# Altium project ndal_STM.PrjPcb
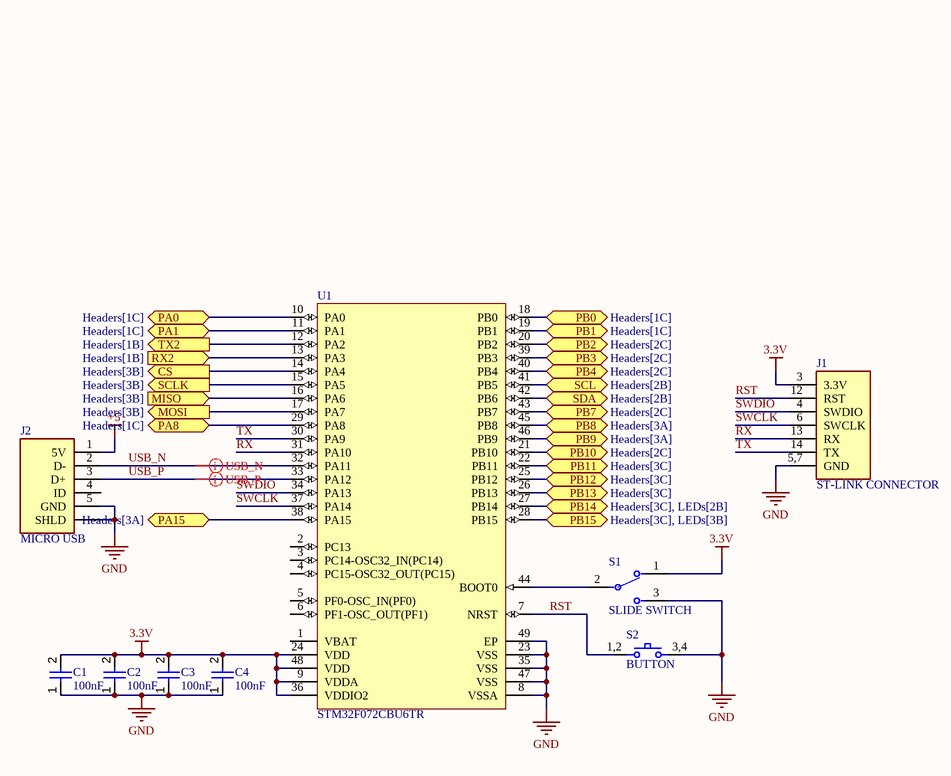
[diagram p0: STM.SchDoc]
4 sheets, 28 parts. Net scope: flat (ports and power ports of the same name join across sheets).
Board file: PCB.PcbDoc
Sheets:
  STM.SchDoc
  Power.SchDoc
  Headers.SchDoc
  LEDs.SchDoc

## Sheet STM.SchDoc
size A; SheetNumber: 1; SheetTotal: 4

### Parts
C1  value 100nF  [CAP_0603]  (hidden comment: CAP .1uF)
C2  value 100nF  [CAP_0603]  (hidden comment: CAP .1uF)
C3  value 100nF  [CAP_0603]  (hidden comment: CAP .1uF)
C4  value 100nF  [CAP_0603]  (hidden comment: CAP .1uF)
J1  ST-LINK CONNECTOR  [FTSH10701LDVKTR]
J2  MICRO USB  [101181940001LF]
S1  SLIDE SWITCH  [SLW8839352AD]
S2  BUTTON  [TS026643BK100SCRD]
U1  STM32F072CBU6TR  [STM-UFQFPN48_L]

### Ports
CS (out, see Headers[3B]), MISO (in, see Headers[3B]), MOSI (out, see Headers[3B]), PA0 (bidir, see Headers[1C]), PA1 (bidir, see Headers[1C]), PA8 (bidir, see Headers[1C]), PA15 (bidir, see Headers[3A]), PB0 (bidir, see Headers[1C]), PB1 (bidir, see Headers[1C]), PB2 (bidir, see Headers[2C]), PB3 (bidir, see Headers[2C]), PB4 (bidir, see Headers[2C]), PB7 (bidir, see Headers[2C]), PB8 (bidir, see Headers[3A]), PB9 (bidir, see Headers[3A]), PB10 (bidir, see Headers[2C]), PB11 (bidir, see Headers[3C]), PB12 (bidir, see Headers[3C]), PB13 (bidir, see Headers[3C]), PB14 (bidir, see Headers[3C], LEDs[2B]), PB15 (bidir, see Headers[3C], LEDs[3B]), RX2 (in, see Headers[1B]), SCL (bidir, see Headers[2B]), SCLK (out, see Headers[3B]), SDA (bidir, see Headers[2B]), TX2 (out, see Headers[1B])

### Nets
3.3V: C1.2 C2.2 C3.2 C4.2 J1.3(3.3V) S1.1 U1.9(VDDA) U1.24(VDD) U1.36(VDDIO2) U1.48(VDD)
+5: J2.1(5V)
GND: C1.1 C2.1 C3.1 C4.1 J1.5,7(GND) J2.5(GND) J2.SHLD S1.3 S2.3,4 U1.8(VSSA) U1.23(VSS) U1.35(VSS) U1.47(VSS) U1.49(EP)
RST: J1.12(RST) S2.1,2 U1.7(NRST)
RX: J1.13(RX) U1.31(PA10)
SWCLK: J1.6(SWCLK) U1.37(PA14)
SWDIO: J1.4(SWDIO) U1.34(PA13)
TX: J1.14(TX) U1.30(PA9)
USB_N: J2.2(D-) U1.32(PA11)
USB_P: J2.3(D+) U1.33(PA12)
NetJ4_1: U1.38(PA15) ; port PA15
NetJ4_2: U1.45(PB8) ; port PB8
NetJ4_3: U1.46(PB9) ; port PB9
NetJ5_1: U1.12(PA2) ; port TX2
NetJ5_2: U1.13(PA3) ; port RX2
NetJ6_1: U1.16(PA6) ; port MISO
NetJ6_2: U1.17(PA7) ; port MOSI
NetJ6_3: U1.15(PA5) ; port SCLK
NetJ6_4: U1.14(PA4) ; port CS
NetJ7_1: U1.42(PB6) ; port SDA
NetJ7_2: U1.41(PB5) ; port SCL
NetJ8_1: U1.10(PA0) ; port PA0
NetJ8_2: U1.11(PA1) ; port PA1
NetJ8_3: U1.29(PA8) ; port PA8
NetJ8_4: U1.18(PB0) ; port PB0
NetJ8_5: U1.19(PB1) ; port PB1
NetJ9_1: U1.20(PB2) ; port PB2
NetJ9_2: U1.39(PB3) ; port PB3
NetJ9_3: U1.40(PB4) ; port PB4
NetJ9_4: U1.43(PB7) ; port PB7
NetJ9_5: U1.21(PB10) ; port PB10
NetJ10_1: U1.22(PB11) ; port PB11
NetJ10_2: U1.25(PB12) ; port PB12
NetJ10_3: U1.26(PB13) ; port PB13
NetJ10_4: U1.27(PB14) ; port PB14
NetJ10_5: U1.28(PB15) ; port PB15
NetS1_2: S1.2(C) U1.44(BOOT0)

Not connected (* = marked no-connect by the designer): J2 4(ID); U1 1(VBAT) 2(PC13) 3(PC14-OSC32_IN(PC14)) 4(PC15-OSC32_OUT(PC15)) 5(PF0-OSC_IN(PF0)) 6(PF1-OSC_OUT(PF1))

### Layout directives
differential pair: USB_N, USB_P

### Library data of the parts
C1-C4 = CMP-001-00086-1: Capacitor .1uF 10% 16V 0603; Voltage Rating: 16V; Source: Generic_Schematic_Library.SchLib; Design Item ID: CAP .1uF; Tolerance: 10%
J1 = CMP-002-00025-2: Connector; Manufacturer_Name: SAMTEC; Manufacturer_Part_Number: FTSH-107-01-L-DV-K-TR; Pins: 7; Design Item ID: ST-LINK CONNECTOR; Component Type: Standard; Source: SamacSys.SchLib; Mouser Part Number: 200-FTSH10701LDVKTR; Arrow Part Number: FTSH-107-01-L-DV-K-TR; Mouser Price/Stock: https://www.mouser.co.uk/ProductDetail/Samtec/FTSH-107-01-L-DV-K-TR?qs=%252BZP6%2F%252BtExtDlh0wyxE013Q%3D%3D; Height: 6.25mm; Arrow Price/Stock: https://www.arrow.com/en/products/ftsh-107-01-l-dv-k-tr/samtec?utm_currency=USD&region=nac; Datasheet Link: https://suddendocs.samtec.com/prints/ftsh-1xx-xx-xxx-dv-xxx-xxx-x-xx-mkt.pdf?_gl=1*mdiyn1*_ga*MTcyMTUxMTIwMy4xNzEyMDQxMTc2*_ga_3KFNZC07WW*MTcxMjEzMDIxOS4yLjEuMTcxMjEzMDI1NC4yNS4wLjA.
J2 = CMP-00030-1: Connector; pin to pad: SHLD>MH1+MH2+MH3+MH4+MP1+MP2; Manufacturer_Name: Amphenol Communications Solutions; Height: 3.25mm; Manufacturer_Part_Number: 10118194-0001LF; Source: SamacSys.SchLib; Design Item ID: 10118194-0001LF; Datasheet Link: https://www.amphenol-cs.com/micro-usb-101181940001lf.html; Arrow Price/Stock: https://www.arrow.com/en/products/10118194-0001lf/amphenol-fci?utm_currency=USD&region=nac; Arrow Part Number: 10118194-0001LF
S1 = CMP-00033-2: Switch; Manufacturer_Name: Same Sky; Design Item ID: SLW-883935-2A-D; Datasheet Link: https://www.sameskydevices.com/product/resource/supplyframepdf/slw-883935-2a-d.pdf; Arrow Part Number: SLW-883935-2A-D; Manufacturer_Part_Number: SLW-883935-2A-D; Height: 6.1mm; Mouser Price/Stock: https://www.mouser.co.uk/ProductDetail/Same-Sky/SLW-883935-2A-D?qs=1Kr7Jg1SGW%2Fv9j8ky6fn%2FQ%3D%3D; Mouser Part Number: 179-SLW-883935-2A-D; Arrow Price/Stock: https://www.arrow.com/en/products/slw-883935-2a-d/cui-devices?utm_currency=USD&region=nac; Source: SamacSys.SchLib
S2 = CMP-00032-1: pin to pad: 1,2>1+2 3,4>3+4; Manufacturer_Name: Same Sky; Mouser Part Number: 179-TS026643BK100SCR; Arrow Part Number: TS02-66-43-BK-100-SCR-D; Datasheet Link: https://www.sameskydevices.com/product/resource/ts02.pdf; Mouser Price/Stock: https://www.mouser.co.uk/ProductDetail/Same-Sky/TS02-66-43-BK-100-SCR-D?qs=A6eO%252BMLsxmSl2Xr0zcGVOg%3D%3D; Manufacturer_Part_Number: TS02-66-43-BK-100-SCR-D; Height: 4.5mm; Source: SamacSys.SchLib; Arrow Price/Stock: https://www.arrow.com/en/products/ts02-66-43-bk-100-scr-d/cui-devices?utm_currency=USD&region=nac; Design Item ID: TS02-66-43-BK-100-SCR-D
U1 = CMP-0304-00174-1: ARM Cortex-M0 32-bit MCU, 128 KB Flash, 16 KB Internal RAM, 37 I/Os, 48-Pin UFQFPN, -40 to 85 degC, Tape and Reel; I/Os (High Current): 37; Internal RAM Size (kB): 16; D/A Converter: 1; FLASH Size (Prog) (kB): 128; Supply Voltage(Vcc) min (V): 2; Operating Frequency(F) (Processor speed) (MHz): 48; DatasheetVersion: Rev. 5; ComponentLink1Description: Manufacturer URL; ComponentLink2URL: http://www.st.com/st-web-ui/static/active/en/resource/technical/document/datasheet/DM00090510.pdf; ComponentLink2Description: Datasheet; Core: ARM Cortex-M0; ComponentLink1URL: http://www.st.com/; Package Reference: UFQFPN48; Packing: Tape and Reel; Mounting Technology: Surface Mount; Package Description: 48-Pin Ultra Thin Fine Pitch Quad Flat No-Lead, 7 x 7 x 0.6 mm Body, 0.5 mm Pitch, Exposed Pad

## Sheet Power.SchDoc
size A; SheetNumber: 2; SheetTotal: 4
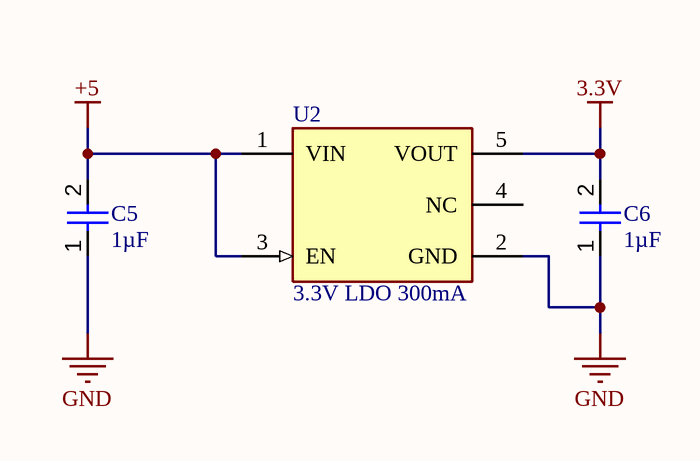
[diagram p1: Power.SchDoc]

### Parts
C5  value 1µF  [CAP_0603]  (hidden comment: CAP 1uF)
C6  value 1µF  [CAP_0603]  (hidden comment: CAP 1uF)
U2  3.3V LDO 300mA  [FP-SOT23-5LD-PL-1-MFG]

### Nets
3.3V: C6.2 U2.5(VOUT)
+5: C5.2 U2.1(VIN) U2.3(EN)
GND: C5.1 C6.1 U2.2(GND)

Not connected (* = marked no-connect by the designer): U2 4(NC)

### Library data of the parts
C5 C6 = CMP-001-00085-1: Capacitor 1uF 10% 16V 0603; Source: Generic_Schematic_Library.SchLib; Voltage Rating: 16V; Design Item ID: CAP 1uF; Tolerance: 10%
U2 = CMP-00031-1: Fixed Positive LDO Regulator, 3.3V, 0.38V Dropout, CMOS, PDSO5; RoHS Compliant: Yes

## Sheet Headers.SchDoc
size A; SheetNumber: 3; SheetTotal: 4
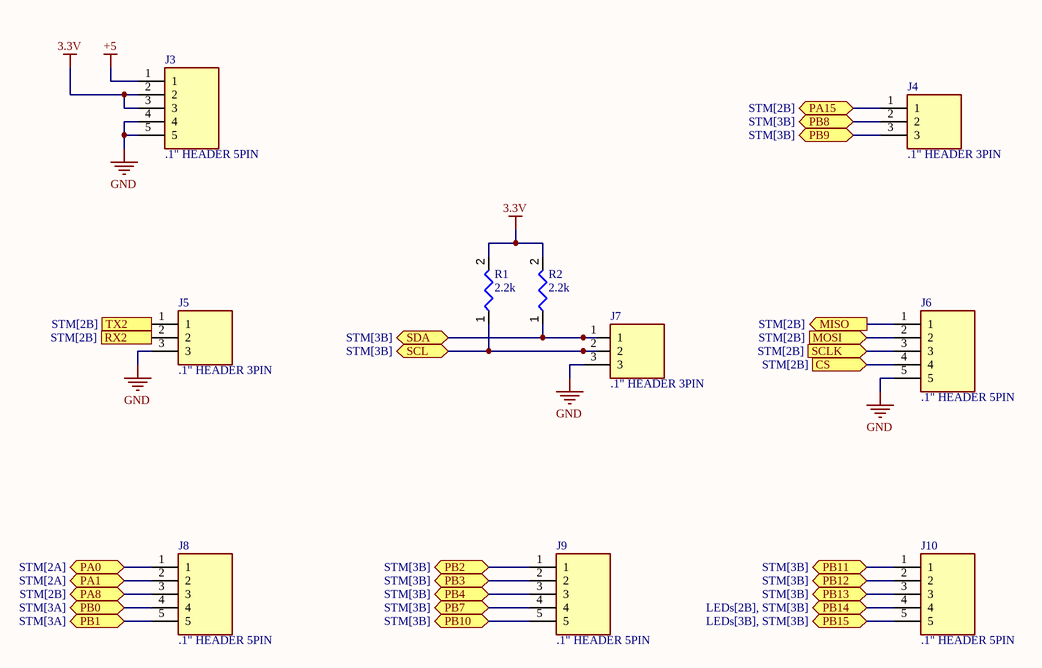
[diagram p2: Headers.SchDoc]

### Parts
J3  .1" HEADER 5PIN  [HDRV5W64P0X254_1X5_1270X250X850P]  (no BOM)
J4  .1" HEADER 3PIN  [HDRV3W64P0X254_1X3_762X250X952P]  (no BOM)
J5  .1" HEADER 3PIN  [HDRV3W64P0X254_1X3_762X250X952P]  (no BOM)
J6  .1" HEADER 5PIN  [HDRV5W64P0X254_1X5_1270X250X850P]  (no BOM)
J7  .1" HEADER 3PIN  [HDRV3W64P0X254_1X3_762X250X952P]  (no BOM)
J8  .1" HEADER 5PIN  [HDRV5W64P0X254_1X5_1270X250X850P]  (no BOM)
J9  .1" HEADER 5PIN  [HDRV5W64P0X254_1X5_1270X250X850P]  (no BOM)
J10  .1" HEADER 5PIN  [HDRV5W64P0X254_1X5_1270X250X850P]  (no BOM)
R1  value 2.2k  [RES_0603]  (hidden comment: RES 2.2k)
R2  value 2.2k  [RES_0603]  (hidden comment: RES 2.2k)

### Ports
CS (in, see STM[2B]), MISO (out, see STM[2B]), MOSI (in, see STM[2B]), PA0 (bidir, see STM[2A]), PA1 (bidir, see STM[2A]), PA8 (bidir, see STM[2B]), PA15 (bidir, see STM[2B]), PB0 (bidir, see STM[3A]), PB1 (bidir, see STM[3A]), PB2 (bidir, see STM[3B]), PB3 (bidir, see STM[3B]), PB4 (bidir, see STM[3B]), PB7 (bidir, see STM[3B]), PB8 (bidir, see STM[3B]), PB9 (bidir, see STM[3B]), PB10 (bidir, see STM[3B]), PB11 (bidir, see STM[3B]), PB12 (bidir, see STM[3B]), PB13 (bidir, see STM[3B]), PB14 (bidir, see LEDs[2B], STM[3B]), PB15 (bidir, see LEDs[3B], STM[3B]), RX2 (out, see STM[2B]), SCL (bidir, see STM[3B]), SCLK (in, see STM[2B]), SDA (bidir, see STM[3B]), TX2 (in, see STM[2B])

### Nets
3.3V: J3.2 J3.3 R1.2 R2.2
+5: J3.1
GND: J3.4 J3.5 J5.3 J6.5 J7.3
NetJ4_1: J4.1 ; port PA15
NetJ4_2: J4.2 ; port PB8
NetJ4_3: J4.3 ; port PB9
NetJ5_1: J5.1 ; port TX2
NetJ5_2: J5.2 ; port RX2
NetJ6_1: J6.1 ; port MISO
NetJ6_2: J6.2 ; port MOSI
NetJ6_3: J6.3 ; port SCLK
NetJ6_4: J6.4 ; port CS
NetJ7_1: J7.1 R2.1 ; port SDA
NetJ7_2: J7.2 R1.1 ; port SCL
NetJ8_1: J8.1 ; port PA0
NetJ8_2: J8.2 ; port PA1
NetJ8_3: J8.3 ; port PA8
NetJ8_4: J8.4 ; port PB0
NetJ8_5: J8.5 ; port PB1
NetJ9_1: J9.1 ; port PB2
NetJ9_2: J9.2 ; port PB3
NetJ9_3: J9.3 ; port PB4
NetJ9_4: J9.4 ; port PB7
NetJ9_5: J9.5 ; port PB10
NetJ10_1: J10.1 ; port PB11
NetJ10_2: J10.2 ; port PB12
NetJ10_3: J10.3 ; port PB13
NetJ10_4: J10.4 ; port PB14
NetJ10_5: J10.5 ; port PB15

### Library data of the parts
J3 J6 J8-J10 = CMP-00039-1: Connector; Source: SamacSys.SchLib; Design Item ID: .1" HEADER 5PIN
J4 J5 J7 = CMP-00038-1: Connector; Design Item ID: .1" HEADER 3PIN; Source: SamacSys.SchLib
R1 R2 = CMP-009-00804-1: Resistor 2.2k 5% 100 mW 0603; Power: 100mW; Source: Generic_Schematic_Library.SchLib; Tolerance: 5%; Design Item ID: RES 2.2k

## Sheet LEDs.SchDoc
size A; SheetNumber: 4; SheetTotal: 4
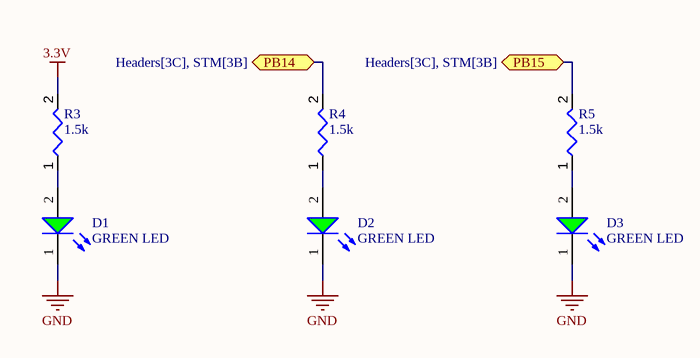
[diagram p3: LEDs.SchDoc]

### Parts
D1  GREEN LED  [WL-SMCW_0603_150060xx75000]
D2  GREEN LED  [WL-SMCW_0603_150060xx75000]
D3  GREEN LED  [WL-SMCW_0603_150060xx75000]
R3  value 1.5k  [RES_0603]  (hidden comment: RES 1.5k)
R4  value 1.5k  [RES_0603]  (hidden comment: RES 1.5k)
R5  value 1.5k  [RES_0603]  (hidden comment: RES 1.5k)

### Ports
PB14 (bidir, see Headers[3C], STM[3B]), PB15 (bidir, see Headers[3C], STM[3B])

### Nets
3.3V: R3.2
GND: D1.1(K) D2.1(K) D3.1(K)
NetD1_2: D1.2(A) R3.1
NetD2_2: D2.2(A) R4.1
NetD3_2: D3.2(A) R5.1
NetJ10_4: R4.2 ; port PB14
NetJ10_5: R5.2 ; port PB15

### Library data of the parts
D1-D3 = CMP-004-00006-2: Single Color LED, Green, Water Clear, 1.1mm; Forward Current: 30mA; Min Operating Temperature: -40°C; Max Operating Temperature: 85°C; Component Type: Standard; RoHS Compliant: Yes; Mounting Technology: Surface Mount; Source: Integrated_Library - 04.08.25 - 13.21.SchLib; Pins: 2; Design Item ID: GREEN LED
R3-R5 = CMP-009-00797-1: Resistor 1.5k 5% 100 mW 0603; Power: 100mW; Source: Generic_Schematic_Library.SchLib; Design Item ID: RES 1.5k; Tolerance: 5%

## Nets that join several sheets
3.3V: STM (10 pins), Power (C6.2 U2.5), Headers (J3.2 J3.3 R1.2 R2.2), LEDs (R3.2)
+5: STM (J2.1), Power (C5.2 U2.1 U2.3), Headers (J3.1)
GND: STM (14 pins), Power (C5.1 C6.1 U2.2), Headers (5 pins), LEDs (D1.1 D2.1 D3.1)
NetJ4_1: STM (U1.38), Headers (J4.1)
NetJ4_2: STM (U1.45), Headers (J4.2)
NetJ4_3: STM (U1.46), Headers (J4.3)
NetJ5_1: STM (U1.12), Headers (J5.1)
NetJ5_2: STM (U1.13), Headers (J5.2)
NetJ6_1: STM (U1.16), Headers (J6.1)
NetJ6_2: STM (U1.17), Headers (J6.2)
NetJ6_3: STM (U1.15), Headers (J6.3)
NetJ6_4: STM (U1.14), Headers (J6.4)
NetJ7_1: STM (U1.42), Headers (J7.1 R2.1)
NetJ7_2: STM (U1.41), Headers (J7.2 R1.1)
NetJ8_1: STM (U1.10), Headers (J8.1)
NetJ8_2: STM (U1.11), Headers (J8.2)
NetJ8_3: STM (U1.29), Headers (J8.3)
NetJ8_4: STM (U1.18), Headers (J8.4)
NetJ8_5: STM (U1.19), Headers (J8.5)
NetJ9_1: STM (U1.20), Headers (J9.1)
NetJ9_2: STM (U1.39), Headers (J9.2)
NetJ9_3: STM (U1.40), Headers (J9.3)
NetJ9_4: STM (U1.43), Headers (J9.4)
NetJ9_5: STM (U1.21), Headers (J9.5)
NetJ10_1: STM (U1.22), Headers (J10.1)
NetJ10_2: STM (U1.25), Headers (J10.2)
NetJ10_3: STM (U1.26), Headers (J10.3)
NetJ10_4: STM (U1.27), Headers (J10.4), LEDs (R4.2)
NetJ10_5: STM (U1.28), Headers (J10.5), LEDs (R5.2)